# Altium schematic sheet Top.SchDoc
size A4
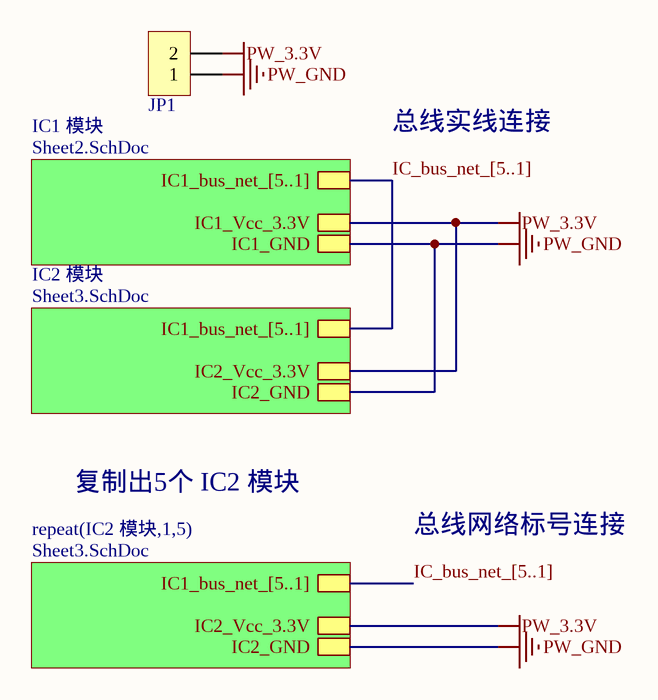
[diagram p0: Top.SchDoc]

## Parts
JP1  HDR-1X2  [HDR2.54-LI-2P]  (value not drawn)

## Sub-sheets
IC1 模块 = Sheet2.SchDoc: IC1_bus_net_[5..1], IC1_Vcc_3.3V, IC1_GND
IC2 模块 = Sheet3.SchDoc: IC1_bus_net_[5..1], IC2_Vcc_3.3V, IC2_GND
repeat(IC2 模块,1,5) = Sheet3.SchDoc: IC1_bus_net_[5..1], IC2_Vcc_3.3V, IC2_GND

## Nets
PW_3.3V: JP1.2 ; sheet IC1 模块/IC1_Vcc_3.3V, sheet IC2 模块/IC2_Vcc_3.3V, sheet repeat(IC2 模块,1,5)/IC2_Vcc_3.3V
PW_GND: JP1.1 ; sheet IC1 模块/IC1_GND, sheet IC2 模块/IC2_GND, sheet repeat(IC2 模块,1,5)/IC2_GND

## Buses and harness runs
bus IC_bus_net_[5..1] = sheet IC1 模块/IC1_bus_net_[5..1] = sheet IC2 模块/IC1_bus_net_[5..1]
bus IC_bus_net_[5..1] = sheet repeat(IC2 模块,1,5)/IC1_bus_net_[5..1]

## Notes on the sheet
- 总线实线连接
- 复制出5个 IC2 模块
- 总线网络标号连接

## Library data of the parts
JP1 = Header 2: 2P接插件; 版权归属: 源创客; BOM名称: 2P接插件; 学习资源: www.ooocke.com